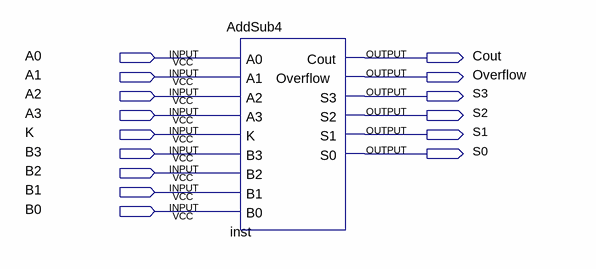
[diagram p0: schematic sheet]
// Quartus schematic AddSubDemo.bdf as structural Verilog: 1 symbols, 15 pins
module AddSubDemo (
  input  A0,
  input  A1,
  input  A2,
  input  A3,
  input  K,
  input  B3,
  input  B2,
  input  B1,
  input  B0,
  output Cout,
  output Overflow,
  output S3,
  output S2,
  output S1,
  output S0
);

  AddSub4 inst (
    .A0(A0), .A1(A1), .A2(A2), .A3(A3), .K(K), .B3(B3), .B2(B2), .B1(B1), .B0(B0), .Cout(Cout),
    .Overflow(Overflow), .S3(S3), .S2(S2), .S1(S1), .S0(S0));
endmodule
